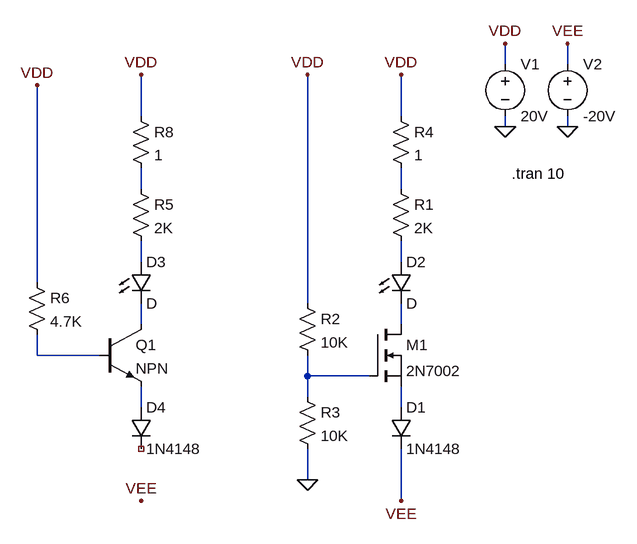
[diagram p0: schematic Signal_SSR_Switched.asc]
Signal_SSR_Switched.asc, the LTspice schematic file:
Version 4
SHEET 1 880 680
WIRE 352 -160 352 -192
WIRE 448 -160 448 -192
WIRE -208 -80 -208 -144
WIRE 192 -80 192 -144
WIRE 352 -64 352 -80
WIRE 448 -64 448 -80
WIRE -208 32 -208 0
WIRE 192 32 192 0
WIRE -208 144 -208 112
WIRE 192 144 192 112
WIRE -368 176 -368 -128
WIRE 48 208 48 -144
WIRE -208 240 -208 208
WIRE 192 240 192 208
WIRE -368 288 -368 256
WIRE -272 288 -368 288
WIRE 48 320 48 288
WIRE 144 320 48 320
WIRE 48 352 48 320
WIRE -208 368 -208 336
WIRE 192 368 192 336
WIRE 48 480 48 432
WIRE 192 512 192 432
FLAG 48 480 0
FLAG 352 -64 0
FLAG 448 -64 0
FLAG 352 -192 VDD
FLAG 448 -192 VEE
FLAG 192 512 VEE
FLAG 48 -144 VDD
FLAG 192 -144 VDD
FLAG -208 512 VEE
FLAG -368 -128 VDD
FLAG -208 -144 VDD
SYMBOL res 176 16 R0
SYMATTR InstName R1
SYMATTR Value 2K
SYMBOL voltage 352 -176 R0
WINDOW 123 0 0 Left 0
WINDOW 39 0 0 Left 0
SYMATTR InstName V1
SYMATTR Value 20V
SYMBOL voltage 448 -176 R0
WINDOW 123 0 0 Left 0
WINDOW 39 0 0 Left 0
SYMATTR InstName V2
SYMATTR Value -20V
SYMBOL nmos 144 240 R0
SYMATTR InstName M1
SYMATTR Value 2N7002
SYMBOL res 32 192 R0
SYMATTR InstName R2
SYMATTR Value 10K
SYMBOL res 32 336 R0
SYMATTR InstName R3
SYMATTR Value 10K
SYMBOL LED 176 144 R0
SYMATTR InstName D2
SYMBOL diode 176 368 R0
SYMATTR InstName D1
SYMATTR Value 1N4148
SYMBOL res 176 -96 R0
SYMATTR InstName R4
SYMATTR Value 1
SYMBOL npn -272 240 R0
SYMATTR InstName Q1
SYMBOL res -224 16 R0
SYMATTR InstName R5
SYMATTR Value 2K
SYMBOL res -384 160 R0
SYMATTR InstName R6
SYMATTR Value 4.7K
SYMBOL LED -224 144 R0
SYMATTR InstName D3
SYMBOL diode -224 368 R0
SYMATTR InstName D4
SYMATTR Value 1N4148
SYMBOL res -224 -96 R0
SYMATTR InstName R8
SYMATTR Value 1
TEXT 362 8 Left 2 !.tran 10

The netlist it stands for:
* Signal_SSR_Switched.asc
R1 N002 N004 2K
V1 VDD 0 20V
V2 VEE 0 -20V
M1 N006 N008 N010 N010 2N7002
R2 VDD N008 10K
R3 N008 0 10K
D2 N004 N006 D
D1 N010 VEE 1N4148
R4 VDD N002 1
Q1 N005 N007 N009 0 NPN
R5 N001 N003 2K
R6 VDD N007 4.7K
D3 N003 N005 D
D4 N009 NC_01 1N4148
R8 VDD N001 1
.model D D
.lib standard.dio
.model NPN NPN
.model PNP PNP
.lib standard.bjt
.model NMOS NMOS
.model PMOS PMOS
.lib standard.mos
.tran 10
.backanno
.end